# Altium schematic sheet ArcNano_Schematic_POWER.SchDoc
size 209 x 148 mm; SheetNumber: 1; SheetTotal: 2
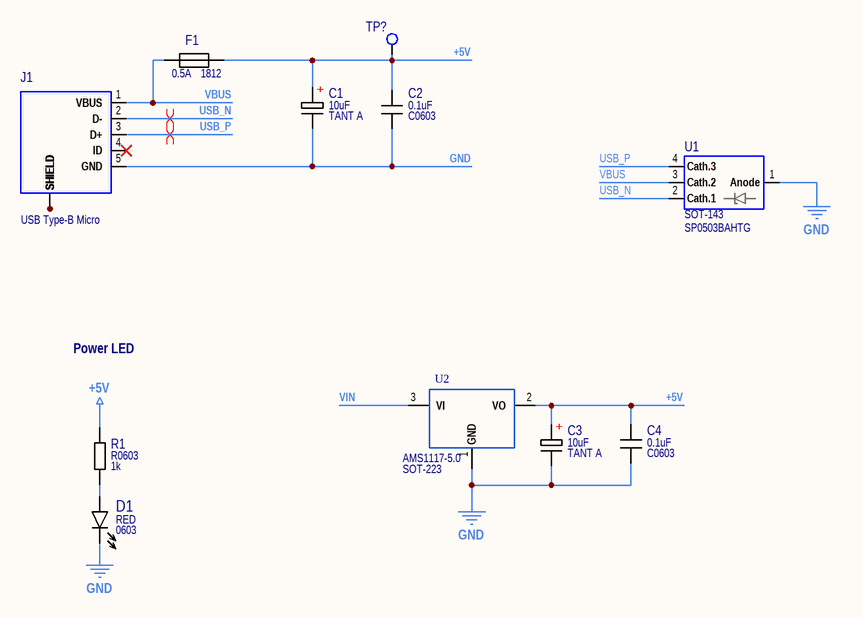
[diagram p0: ArcNano_Schematic_POWER.SchDoc]

## Parts
C1  value 10uF  [TANT A]
C2  value 0.1uF  [C0603]
C3  value 10uF  [TANT A]
C4  value 0.1uF  [C0603]
D1  value RED  Case: 0603  [D0603_LED_RED]
F1  value 0.5A  Case: 1812  [MF-MSMF050]
J1  USB Type-B Micro  [USB MOLEX 1050170001]
R1  value 1k  [R0603]
TP?  (no value)  [TP]  (graphical)
U1  Case: SOT-143  [SOT143-4]  (hidden comment: SP0503BAHTG)
U2  AMS1117-5.0  [SOT-223]

## Nets
+5V: C1.1 C2.2 C3.1 C4.2 F1.2 R1.1 TP?.1 U2.2(VO)
GND: C1.2 C2.1 C3.2 C4.1 D1.2 J1.5(GND) U1.1(Anode) U2.1(GND)
USB_N: J1.2(D-) U1.2(Cath.1)
USB_P: J1.3(D+) U1.4(Cath.3)
VBUS: F1.1 J1.1(VBUS) U1.3(Cath.2)
VIN: U2.3(VI)
NetD1_1: D1.1 R1.2
NetJ1_SH1: J1.SH1(SHIELD) J1.SH2(SHIELD) J1.SH3(SHIELD) J1.SH4(SHIELD) J1.SH5(SHIELD) J1.SH6(SHIELD) J1.SH7(SHIELD) J1.SH8(SHIELD)

Not connected (* = marked no-connect by the designer): J1 4(ID)*

## Layout directives
differential pair: USB_N, USB_P

## Notes on the sheet
- Power LED
- (in symbol Capacitor_POL) +

## Library data of the parts
C1 C3 = Capacitor_POL: Manufacturer: AVX; Model: TAJA106K016RNJ; HelpURL: https://lcsc.com/product-detail/Tantalum-Capacitors_AVX-TAJA106K016RNJ_C7171.html; Case: TANT A; JLCPCB Part #: C7171; MFR.Part #: TAJA106K016RNJ
C2 C4 = Capacitor: Manufacturer: Murata Electronics; Model: GRM188R71H104KA93D; HelpURL: https://lcsc.com/product-detail/Multilayer-Ceramic-Capacitors-MLCC-SMD-SMT_Murata-Electronics-GRM188R71H104KA93D_C77055.html; Case: C0603; JLCPCB Part #: C77055; MFR.Part #: GRM188R71H104KA93D
D1 = LED: Manufacturer: Everlight Elec; Model: 19-217/R6C-AL1M2VY/3T; HelpURL: https://lcsc.com/product-detail/Light-Emitting-Diodes-LED_Everlight-Elec-19-217-R6C-AL1M2VY-3T_C72044.html; JLCPCB Part #: C72044; MFR.Part #: 19-217/R6C-AL1M2VY/3T
F1 = Fuse: Manufacturer: Bourns; MFR.Part #: MF-MSMF050-2; HelpURL: https://lcsc.com/product-detail/Resettable-Fuses_BOURNS-MF-MSMF050-2_C17313.html; Model: MF-MSMF050; JLCPCB Part #: C17313
J1 = USB Type-B Micro: USB - micro B USB 2.0 Receptacle Connector 5 Position Surface Mount, Right Angle; Through Hole; Manufacturer: Molex; MFR.Part #: 1050170001; Model: USB Type-B Micro; Value: *; HelpURL: https://lcsc.com/product-detail/USB-Connectors_MOLEX-1050170001_C136000.html; Case: USB Type-B Micro; JLCPCB Part #: C136000
R1 = Resistor: Manufacturer: YAGEO; Model: RC0603JR-071KL; HelpURL: https://lcsc.com/product-detail/Chip-Resistor-Surface-Mount_YAGEO-RC0603JR-071KL_C14676.html; Case: R0603; JLCPCB Part #: C14676; MFR.Part #: RC0603JR-071KL
TP? = Test Point: Net: +5V
U1 = SP0503BAHTG: TVS DIODE 5.5V 8.5V; Manufacturer: Littelfuse Inc.; HelpURL: https://lcsc.com/product-detail/TVS_Littelfuse-SP0503BAHTG_C7074.html; Model: SP0503BAHTG; JLCPCB Part #: C7074; MFR.Part #: SP0503BAHTG; Value: *
U2 = AMS1117-5.0: Manufacturer: Advanced Monolithic Systems; HelpURL: https://lcsc.com/product-detail/Linear-Voltage-Regulators-LDO_Advanced-Monolithic-Systems-AMS1117-5-0_C6187.html; Case: SOT-223; Model: AMS1117-5.0; JLCPCB Part #: C6187; MFR.Part #: AMS1117-5.0; Value: *